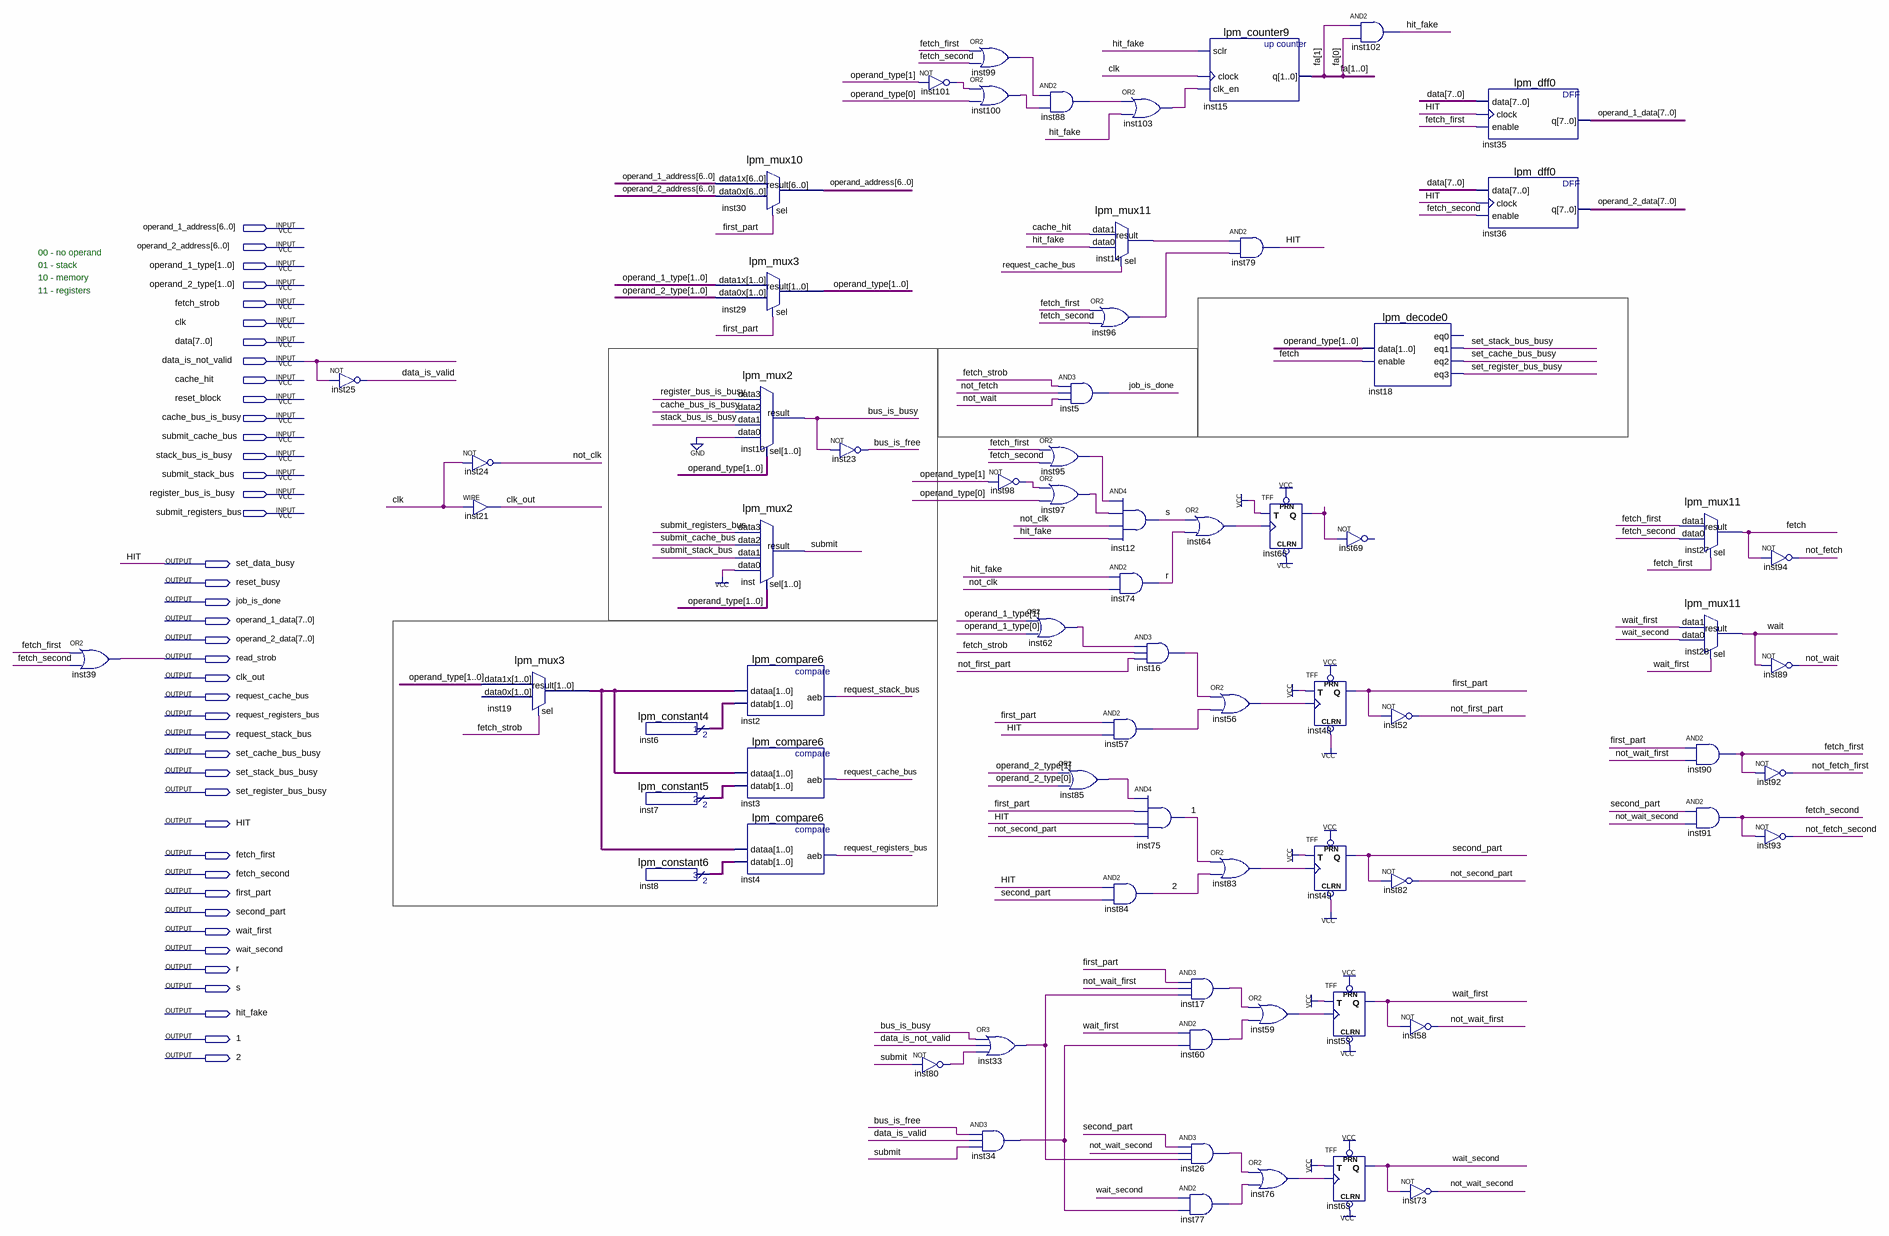
[diagram p0: schematic sheet]
// Quartus schematic DataFetchBlock.bdf as structural Verilog: 71 symbols, 41 pins
module DataFetchBlock (
  input  [6:0] operand_1_address,
  input  [6:0] operand_2_address,
  input  [1:0] operand_1_type,
  input  [1:0] operand_2_type,
  input  fetch_strob,
  input  clk,
  input  [7:0] data,
  input  data_is_not_valid,
  input  cache_hit,
  input  reset_block,
  input  cache_bus_is_busy,
  input  submit_cache_bus,
  input  stack_bus_is_busy,
  input  submit_stack_bus,
  input  register_bus_is_busy,
  input  submit_registers_bus,
  output set_data_busy,
  output reset_busy,
  output job_is_done,
  output [7:0] operand_1_data,
  output [7:0] operand_2_data,
  output read_strob,
  output clk_out,
  output request_cache_bus,
  output request_registers_bus,
  output request_stack_bus,
  output set_cache_bus_busy,
  output set_stack_bus_busy,
  output set_register_bus_busy,
  output HIT,
  output fetch_first,
  output fetch_second,
  output first_part,
  output second_part,
  output wait_first,
  output wait_second,
  output r,
  output s,
  output hit_fake,
  output \1 ,
  output \2 
);

  wire bus_is_busy, bus_is_free, data_is_valid, fetch, inst14_result, inst16_out, inst17_out, inst26_out,
       inst33_out, inst34_out, inst56_out, inst57_out, inst59_out, inst60_out, inst62_out, inst64_out,
       inst66_q, inst76_out, inst77_out, inst80_out, inst83_out, inst85_out, inst88_out, inst95_out,
       inst96_out, inst97_out, inst98_out, inst99_out, inst100_out, inst101_out, inst103_out, not_clk,
       not_fetch, not_fetch_first, not_fetch_second, not_first_part, not_second_part, not_wait,
       not_wait_first, not_wait_second, submit, \wait ;
  wire [1:0] fa, inst6_result, inst7_result, inst8_result, inst19_result, operand_type;
  wire [6:0] operand_address;

  or inst39 (read_strob, fetch_first, fetch_second);
  not inst25 (data_is_valid, data_is_not_valid);
  not inst24 (not_clk, clk);
  assign clk_out = clk;  // WIRE inst21
  lpm_mux3 inst19 (.data1x(operand_type), .sel(fetch_strob), .result(inst19_result));  // open: data0x
  lpm_constant4 inst6 (.result(inst6_result));
  lpm_constant5 inst7 (.result(inst7_result));
  lpm_constant6 inst8 (.result(inst8_result));
  lpm_mux10 inst30 (.data1x(operand_1_address), .data0x(operand_2_address), .sel(first_part), .result(operand_address));
  lpm_mux3 inst29 (.data1x(operand_1_type), .data0x(operand_2_type), .sel(first_part), .result(operand_type));
  lpm_mux2 inst10 (
    .data3(register_bus_is_busy), .data2(cache_bus_is_busy), .data1(stack_bus_is_busy), .data0(1'b0),
    .sel(operand_type), .result(bus_is_busy));
  lpm_mux2 inst (
    .data3(submit_registers_bus), .data2(submit_cache_bus), .data1(submit_stack_bus), .data0(1'b1),
    .sel(operand_type), .result(submit));
  lpm_compare6 inst2 (.dataa(inst19_result), .datab(inst6_result), .aeb(request_stack_bus));
  lpm_compare6 inst3 (.dataa(inst19_result), .datab(inst7_result), .aeb(request_cache_bus));
  lpm_compare6 inst4 (.dataa(inst19_result), .datab(inst8_result), .aeb(request_registers_bus));
  not inst23 (bus_is_free, bus_is_busy);
  not inst101 (inst101_out, operand_type[1]);
  not inst80 (inst80_out, submit);
  or inst99 (inst99_out, fetch_first, fetch_second);
  or inst100 (inst100_out, inst101_out, operand_type[0]);
  not inst98 (inst98_out, operand_type[1]);
  or inst33 (inst33_out, bus_is_busy, data_is_not_valid, inst80_out);
  and inst34 (inst34_out, bus_is_free, data_is_valid, submit);
  and inst88 (inst88_out, inst99_out, inst100_out);
  and inst5 (job_is_done, fetch_strob, not_fetch, not_wait);
  or inst95 (inst95_out, fetch_first, fetch_second);
  or inst97 (inst97_out, inst98_out, operand_type[0]);
  or inst62 (inst62_out, operand_1_type[1], operand_1_type[0]);
  or inst85 (inst85_out, operand_2_type[1], operand_2_type[0]);
  lpm_mux11 inst14 (.data1(cache_hit), .data0(hit_fake), .sel(request_cache_bus), .result(inst14_result));
  or inst96 (inst96_out, fetch_first, fetch_second);
  and inst12 (s, inst95_out, inst97_out, not_clk, hit_fake);
  and inst74 (r, hit_fake, not_clk);
  and inst57 (inst57_out, first_part, HIT);
  and inst84 (\2 , HIT, second_part);
  or inst103 (inst103_out, inst88_out, hit_fake);
  and inst16 (inst16_out, inst62_out, fetch_strob, not_first_part);
  and inst75 (\1 , inst85_out, first_part, HIT, not_second_part);
  lpm_counter9 inst15 (.sclr(hit_fake), .clock(clk), .clk_en(inst103_out), .q(fa));
  or inst64 (inst64_out, s, r);
  or inst56 (inst56_out, inst16_out, inst57_out);
  or inst83 (inst83_out, \1 , \2 );
  and inst17 (inst17_out, first_part, not_wait_first, inst33_out);
  and inst60 (inst60_out, wait_first, inst34_out);
  and inst26 (inst26_out, second_part, not_wait_second, inst33_out);
  and inst77 (inst77_out, wait_second, inst34_out);
  and inst79 (HIT, inst14_result, inst96_out);
  TFF inst66 (.PRN(1'b1), .CLRN(1'b1), .T(1'b1), .CLK(inst64_out), .Q(inst66_q));
  or inst59 (inst59_out, inst17_out, inst60_out);
  or inst76 (inst76_out, inst26_out, inst77_out);
  TFF inst48 (.PRN(1'b1), .CLRN(1'b1), .T(1'b1), .CLK(inst56_out), .Q(first_part));
  TFF inst49 (.PRN(1'b1), .CLRN(1'b1), .T(1'b1), .CLK(inst83_out), .Q(second_part));
  and inst102 (hit_fake, fa[1], fa[0]);
  lpm_decode0 inst18 (
    .data(operand_type), .enable(fetch), .eq1(set_stack_bus_busy), .eq2(set_cache_bus_busy),
    .eq3(set_register_bus_busy));  // open: eq0
  // NOT inst69 has open pins: IN=inst66_q, OUT=open
  TFF inst53 (.PRN(1'b1), .CLRN(1'b1), .T(1'b1), .CLK(inst59_out), .Q(wait_first));
  TFF inst63 (.PRN(1'b1), .CLRN(1'b1), .T(1'b1), .CLK(inst76_out), .Q(wait_second));
  not inst52 (not_first_part, first_part);
  not inst82 (not_second_part, second_part);
  not inst58 (not_wait_first, wait_first);
  not inst73 (not_wait_second, wait_second);
  lpm_dff0 inst35 (.data(data), .clock(HIT), .enable(fetch_first), .q(operand_1_data));
  lpm_dff0 inst36 (.data(data), .clock(HIT), .enable(fetch_second), .q(operand_2_data));
  lpm_mux11 inst27 (.data1(fetch_first), .data0(fetch_second), .sel(fetch_first), .result(fetch));
  lpm_mux11 inst28 (.data1(wait_first), .data0(wait_second), .sel(wait_first), .result(\wait ));
  and inst90 (fetch_first, first_part, not_wait_first);
  and inst91 (fetch_second, second_part, not_wait_second);
  not inst94 (not_fetch, fetch);
  not inst89 (not_wait, \wait );
  not inst92 (not_fetch_first, fetch_first);
  not inst93 (not_fetch_second, fetch_second);

  assign set_data_busy = HIT;

  // Notes on the sheet:
  //   00 - no operand
  //   01 - stack
  //   10 - memory
  //   11 - registers
endmodule
